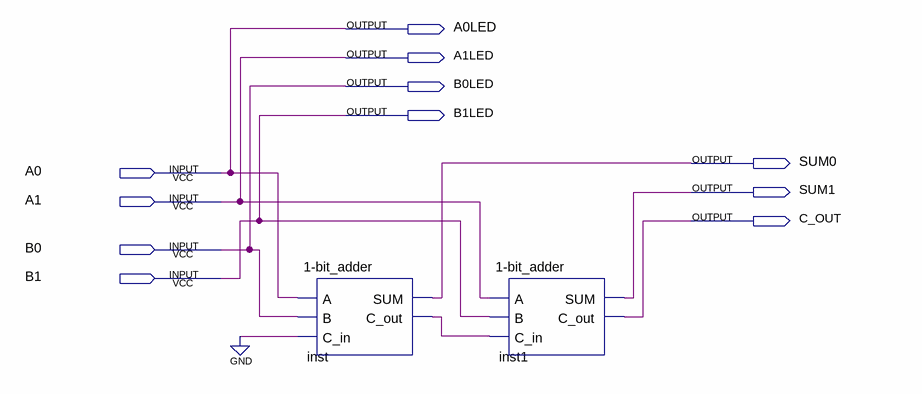
[diagram p0: schematic sheet]
// Quartus schematic 2-bit_adder.bdf as structural Verilog: 2 symbols, 11 pins
module \2-bit_adder  (
  input  A0,
  input  A1,
  input  B0,
  input  B1,
  output A0LED,
  output A1LED,
  output B0LED,
  output B1LED,
  output SUM0,
  output SUM1,
  output C_OUT
);

  wire inst_c_out;

  \1-bit_adder  inst (.A(A0), .B(B0), .C_in(1'b0), .SUM(SUM0), .C_out(inst_c_out));
  \1-bit_adder  inst1 (.A(A1), .B(B1), .C_in(inst_c_out), .SUM(SUM1), .C_out(C_OUT));

  assign A0LED = A0;
  assign A1LED = A1;
  assign B0LED = B0;
  assign B1LED = B1;
endmodule
